# Altium schematic sheet DAC.SchDoc
size 279 x 215 mm; SheetNumber: 4; SheetTotal: 6; SPICEModelCacheRUGZJIPY: <root> / <DocumentId>RUGZJIPY</DocumentId> / <CacheFrame Number="0"> / <Model Name="cap" Kind="MDL"> / <Text>*Default semiconductor capacitor / .MODEL CAP C()</Text> / </Model> / </CacheFrame> / </root>
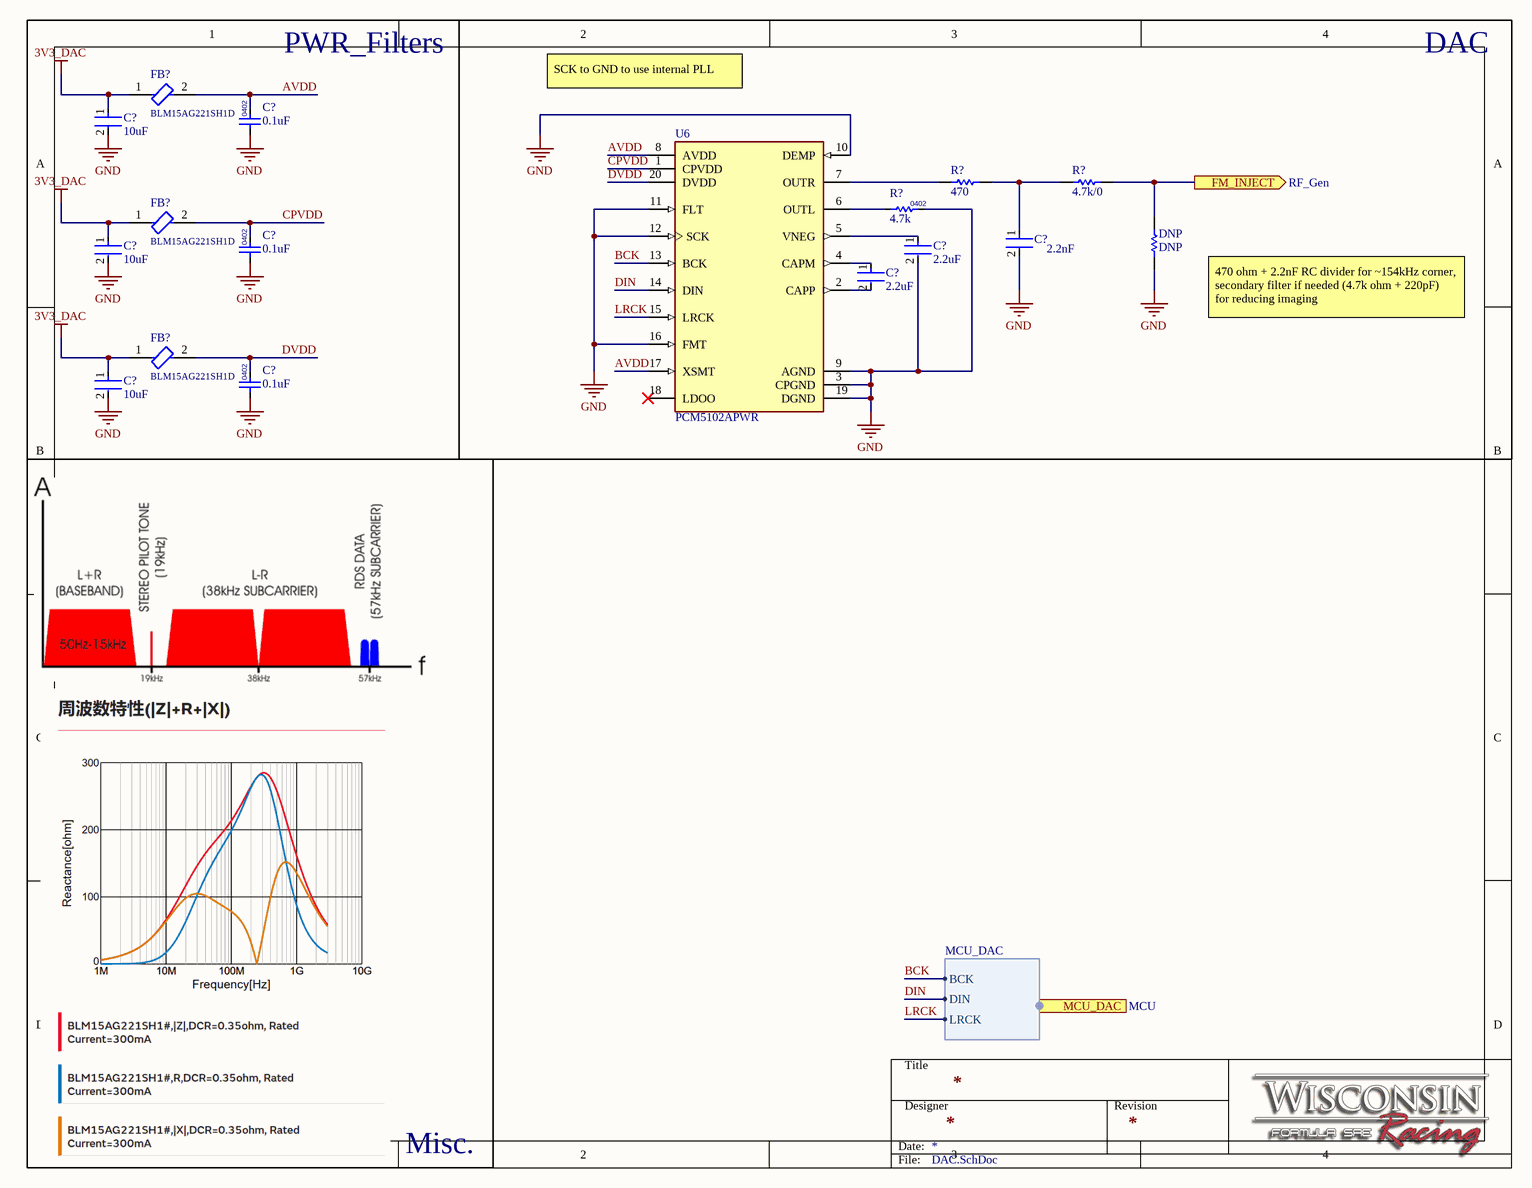
[diagram p0: DAC.SchDoc]

## Parts
(Parts that share a designator on the sheet are numbered #1, #2 ... from top to bottom, then left to right.)
C?#1  10uF  [FP-GRM155-0_2-IPC_A]
C?#2  0.1uF  [FP-CC0402-IPC_B]
C?#3  2.2nF  [FP-GRM155-0_05-IPC_C]
C?#4  10uF  [FP-GRM155-0_2-IPC_A]
C?#5  2.2uF  [FP-GRM155-0_2-IPC_B]
C?#6  0.1uF  [FP-CC0402-IPC_B]
C?#7  2.2uF  [FP-GRM155-0_2-IPC_B]
C?#8  10uF  [FP-GRM155-0_2-IPC_A]
C?#9  0.1uF  [FP-CC0402-IPC_B]
DNP  DNP  [RESC1005X40X25NL05T10]
FB?#1  BLM15AG221SH1D  [FP-BLM15-0_05-MFG]
FB?#2  BLM15AG221SH1D  [FP-BLM15-0_05-MFG]
FB?#3  BLM15AG221SH1D  [FP-BLM15-0_05-MFG]
R?#1  470  [RESC1005X40X25ML05T10]
R?#2  4.7k/0  [RESC1005X40X25NL05T10]
R?#3  value 4.7k  [RESC1005X40X25NL05T10]  (hidden comment: 4.7k 1%)
U6  PCM5102APWR  [FP-PW0020A-IPC_A]

## Blocks framed on the sheet
PWR_Filters: C?#1 C?#2 C?#4 C?#6 C?#8 C?#9 FB?#1-FB?#3
DAC: C?#3 C?#5 C?#7 DNP R?#1-R?#3 U6

## Ports
FM_INJECT (out, see RF_Gen), MCU_DAC (harness MCU_DAC, see MCU)

## Harnesses
MCU_DAC: BCK, DIN, LRCK

## Nets
3V3_DAC: C?#1.1 C?#4.1 C?#8.1 FB?#1.1 FB?#2.1 FB?#3.1
GND: C?#1.2 C?#2.1 C?#3.2 C?#4.2 C?#5.2 C?#6.1 C?#8.2 C?#9.1 DNP.1 R?#3.2 U6.3(CPGND) U6.9(AGND) U6.10(DEMP) U6.11(FLT) U6.12(SCK) U6.16(FMT) U6.19(DGND)
AVDD: C?#2.2 FB?#1.2 U6.8(AVDD) U6.17(XSMT)
BCK: U6.13(BCK) ; port MCU_DAC.BCK
CPVDD: C?#6.2 FB?#2.2 U6.1(CPVDD)
DIN: U6.14(DIN) ; port MCU_DAC.DIN
DVDD: C?#9.2 FB?#3.2 U6.20(DVDD)
FM_INJECT: DNP.2 R?#2.2 ; port FM_INJECT
LRCK: U6.15(LRCK) ; port MCU_DAC.LRCK
NetC?#3_1: C?#3.1 R?#1.2 R?#2.1
NetC?#5_1: C?#5.1 U6.5(VNEG)
NetC?#7_1: C?#7.1 U6.4(CAPM)
NetC?#7_2: C?#7.2 U6.2(CAPP)
NetR?#1_1: R?#1.1 U6.7(OUTR)
NetR?#3_1: R?#3.1 U6.6(OUTL)

Not connected (* = marked no-connect by the designer): U6 18(LDOO)*

## Notes on the sheet
- SCK to GND to use internal PLL
- 470 ohm + 2.2nF RC divider for ~154kHz corner, secondary filter if needed (4.7k ohm + 220pF)  for reducing imaging
- Misc.
- Title
- Designer
- Revision
- Date:
- File:
- (in symbol CMP-Cap-00006-1) 0402

## Library data of the parts
C?#1 C?#4 C?#8 = CMP-06035-061139-1: Chip Multilayer Ceramic Capacitors for General Purpose, 0402, 10uF, X5R, 15%, 20%, 6.3V
C?#2 C?#6 C?#9 = CMP-Cap-00006-1: Ceramic Capacitor, Multilayer, Ceramic, 16V, 10% +Tol, 10% -Tol, X7R, 15% TC, 0.1uF, Surface Mount, 0402; Dielectric: XR7; Capacitance: 100nF; Tolerance: 10%; Voltage Rating: 16V
C?#3 = CMP-06035-062041-1: Chip Multilayer Ceramic Capacitors for General Purpose, 0402, 2200pF, C0G, 30ppm/°C, 5%, 50V
C?#5 C?#7 = CMP-06035-003072-1: Chip Multilayer Ceramic Capacitors for General Purpose, 0402, 2.2uF, X7R, 15%, 10%, 10V; Case/Package: 0402
DNP R?#2 = CMP-1011-00001-2: Manufacturer: Yageo / Phycomp; Part Number: RC0402JR-070RL
FB?#1-FB?#3 = CMP-06046-002173-1: Chip Ferrite Bead, 0402, 220Ω @ 100MHz, 0.35Ω, 25%, 300mA; Impedance: 220R; Number of Lines: 1; DC Resistance (DCR): 350mR; Package Quantity: 10000; Max Operating Temperature: 125°C; Case Code (Imperial): 0402; Ratings: AEC-Q200; Packaging: Tape and Reel; Width: 0.5mm; Core Material: Ferrite; Length: 0.039inch; Max Current Rating: 300mA; REACH SVHC: No SVHC; Weight: 2.3E-05oz; Height: 0.022inch; Max DC Current: 300mA; Series: EMIFIL®, BLM15A_SH; Test Frequency: 100MHz; Min Operating Temperature: -55°C; Termination: SMD/SMT; Mount: Surface Mount; Case Code (Metric): 1005; Depth: 0.55mm; Case/Package: 0402; RoHS Compliant: Yes; Tolerance: 25%; Number of Circuits: 1
R?#1 = CMP-2002-07697-1: Part Number: RC0402FR-07470RL; Manufacturer: Yageo / Phycomp
R?#3 = CMP-00178-1: Res General Purpose Thick Film 0402 4.7K Ohm 1% 1/16W ±100ppm/°C Molded SMD Paper T/R; Power Rating: 63mW; Voltage Rating (AC): 50V; Power Dissipation: 62.5mW; REACH SVHC: Yes; Harmonized Tariff Schedule (HTS) Code: 8533.21.00.30; Composition: Thick Film; Max Operating Temperature: 155°C; Number of Terminals: 2; Min Operating Temperature: -55°C; Depth: 500µm; Introduction Date: 2008-07-18; Case Code (Metric): 1005; Pins: 2; Packaging: Tape & Reel; Height: 350µm; China RoHS: Non-Compliant; Lead Free: Lead Free; Termination: SMD/SMT; Tolerance: 1%; Schedule B: 8533210045, 8533210045; Length: 1mm; Lifecycle Status: Production; Case Code (Imperial): 0402; RoHS: Compliant; Width: 500µm; Mounting Technology: Surface Mount; Temperature Coefficient: 100ppm/°C; Export Control Classification Number (ECCN) Code: EAR99; Country of Origin: Mainland China, Taiwan; Working Voltage: 50V; Voltage Rating: 50V; Case/Package: 0402; Voltage Rating (DC): 50V; Military Standard: Not
U6 = CMP-04861-000013-1: IC DAC 16/24/32BIT 384K 20TSSOP; Power Consumption: 59.4mW; Number of Analog Inputs: 0; Supply Type: Analog; Resolution: 32b; Number of Analog Outputs: 2; Max Power Dissipation: 187mW; Sampling Rate: 384KS/s; Operating Supply Voltage: 3.3V; Number of Bits: 32; Max Supply Voltage: 3.6V; Interface: Serial; Polarity: Unipolar; Min Supply Voltage: 3V; Output Type: Voltage; Signal to Noise Ratio (SNR): 112dB; Contact Plating: Gold; Package Quantity: 2000; Number of Pins: 20; Max Operating Temperature: 85°C; Series: DirectPath™; Case/Package: TSSOP; Conversion Rate: 384KS/s; Number of DAC Channels: 2; Mount: Surface Mount; REACH SVHC: No SVHC; Packaging: Tape and Reel; Number of Converters: 2; Min Operating Temperature: -25°C; Lead Free: Lead Free